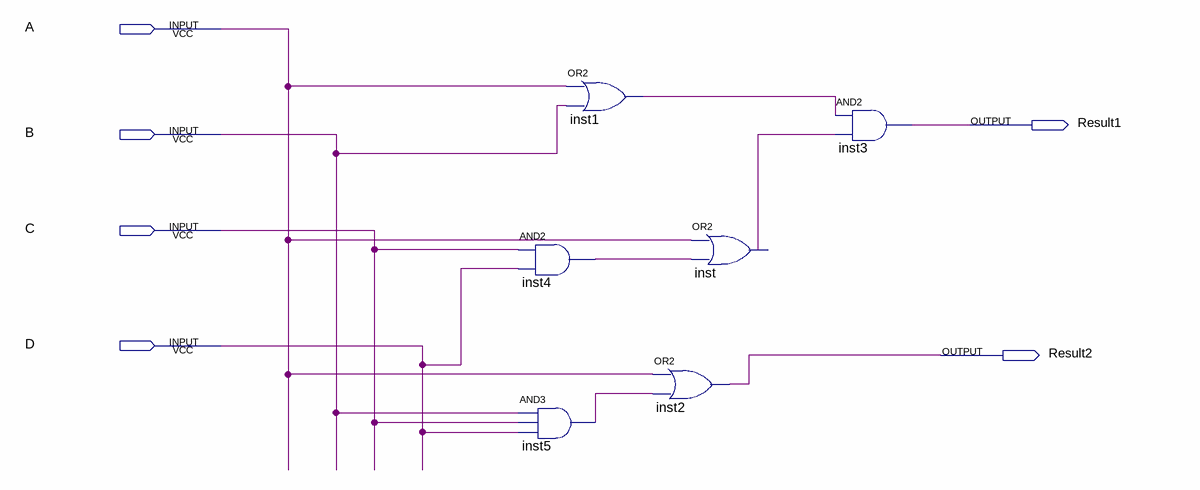
[diagram p0: schematic sheet]
// Quartus schematic LAB_2_1.bdf as structural Verilog: 6 symbols, 6 pins
module LAB_2_1 (
  input  A,
  input  B,
  input  C,
  input  D,
  output Result1,
  output Result2
);

  wire inst1_out, inst4_out, inst5_out, inst_out;

  or inst1 (inst1_out, A, B);
  and inst4 (inst4_out, C, D);
  and inst5 (inst5_out, B, C, D);
  or inst (inst_out, A, inst4_out);
  or inst2 (Result2, A, inst5_out);
  and inst3 (Result1, inst1_out, inst_out);
endmodule
